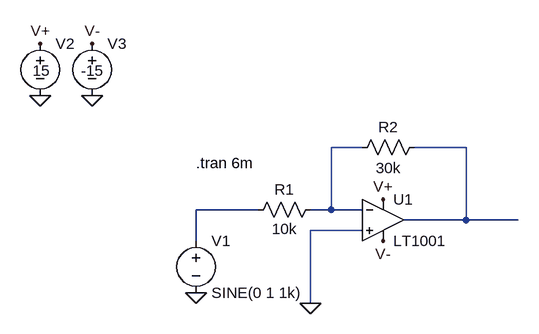
[diagram p0: schematic Invertoivavahvistin.asc]
Invertoivavahvistin.asc, the LTspice schematic file:
Version 4
SHEET 1 880 680
WIRE 336 -32 288 -32
WIRE 496 -32 416 -32
WIRE 176 64 80 64
WIRE 288 64 288 -32
WIRE 288 64 256 64
WIRE 336 64 288 64
WIRE 496 80 496 -32
WIRE 496 80 400 80
WIRE 576 80 496 80
WIRE 336 96 256 96
WIRE 80 112 80 64
WIRE 256 208 256 96
FLAG 80 192 0
FLAG -80 -112 0
FLAG -160 -112 0
FLAG 256 208 0
FLAG 368 48 V+
FLAG -160 -192 V+
FLAG 368 112 V-
FLAG -80 -192 V-
SYMBOL Opamps\\LT1001 368 16 R0
SYMATTR InstName U1
SYMBOL voltage 80 96 R0
WINDOW 123 0 0 Left 2
WINDOW 39 0 0 Left 2
SYMATTR InstName V1
SYMATTR Value SINE(0 1 1k)
SYMBOL voltage -160 -208 R0
WINDOW 3 -12 58 Left 2
WINDOW 123 0 0 Left 2
WINDOW 39 0 0 Left 2
SYMATTR InstName V2
SYMATTR Value 15
SYMBOL voltage -80 -208 R0
WINDOW 3 -17 58 Left 2
WINDOW 123 0 0 Left 2
WINDOW 39 0 0 Left 2
SYMATTR InstName V3
SYMATTR Value -15
SYMBOL res 272 48 R90
WINDOW 0 0 56 VBottom 2
WINDOW 3 30 56 VTop 2
SYMATTR InstName R1
SYMATTR Value 10k
SYMBOL res 432 -48 R90
WINDOW 0 0 56 VBottom 2
WINDOW 3 32 56 VTop 2
SYMATTR InstName R2
SYMATTR Value 30k
TEXT 80 -8 Left 2 !.tran 6m

The netlist it stands for:
* Invertoivavahvistin.asc
XU1 0 N001 V+ V- N002 LT1001  ; pins In+ In- V+ V- OUT
V1 N003 0 SINE(0 1 1k)
V2 V+ 0 15
V3 V- 0 -15
R1 N001 N003 10k
R2 N002 N001 30k
.tran 6m
.lib LTC.lib
.backanno
.end